# Altium project 数控936.PrjPcb
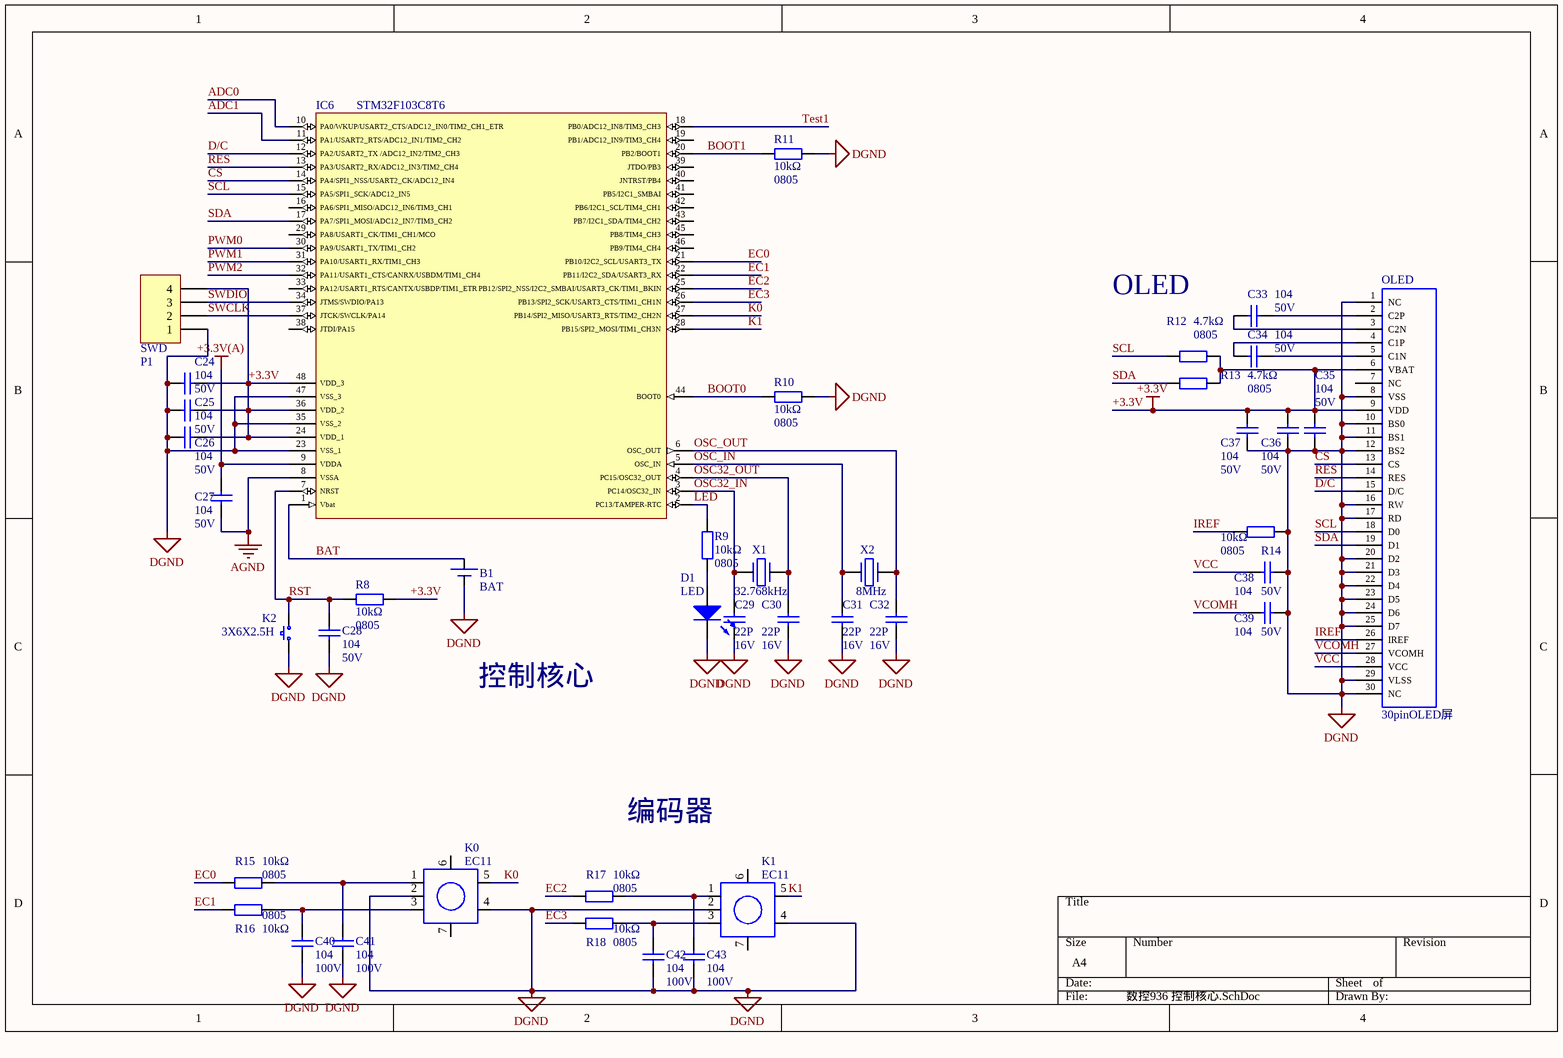
[diagram p0: 数控936 控制核心.SchDoc]
3 sheets, 106 parts. Net scope: global (net labels, ports and power ports of the same name join across sheets).
Board files: 数控936.PcbDoc, 兔子.PcbDoc, 936.PcbDoc
Sheets:
  数控936 控制核心.SchDoc
  数控936 电源部分.SchDoc
  数控936 模拟部分.SchDoc

## Sheet 数控936 控制核心.SchDoc
size A4

### Parts
B1  BAT  [CR1220]
C24  104  value 50V  [C0805]
C25  104  value 50V  [C0805]
C26  104  value 50V  [C0805]
C27  104  value 50V  [C0805]
C28  104  value 50V  [C0805]
C29  22P  value 16V  [C0805]
C30  22P  value 16V  [C0805]
C31  22P  value 16V  [C0805]
C32  22P  value 16V  [C0805]
C33  104  value 50V  [C0805]
C34  104  value 50V  [C0805]
C35  104  value 50V  [C0805]
C36  104  value 50V  [C0805]
C37  104  value 50V  [C0805]
C38  104  value 50V  [C0805]
C39  104  value 50V  [C0805]
C40  104  value 100V  [C0805]
C41  104  value 100V  [C0805]
C42  104  value 100V  [C0805]
C43  104  value 100V  [C0805]
D1  LED  [LED0805(蓝色)]
IC6  STM32F103C8T6  [LQFP-48(0.5MM) - duplicate]
K0  EC11  [EC11]
K1  EC11  [EC11]
K2  3X6X2.5H  [3X6X2.5H]
OLED  30pinOLED屏  [OLED-0.96(穿透)]
P1  SWD  [HDR2.54-LI-4P]
R8  10kΩ  value 0805  [R0805]
R9  10kΩ  value 0805  [R0805]
R10  10kΩ  value 0805  [R0805]
R11  10kΩ  value 0805  [R0805]
R12  4.7kΩ  value 0805  [R0805]
R13  4.7kΩ  value 0805  [R0805]
R14  10kΩ  value 0805  [R0805]
R15  10kΩ  value 0805  [R0805]
R16  10kΩ  value 0805  [R0805]
R17  10kΩ  value 0805  [R0805]
R18  10kΩ  value 0805  [R0805]
X1  32.768kHz  [OSC-2x6-WS]
X2  8MHz  [OSC HC-49SMD]

### Nets
+3.3V: C24.2 C25.2 C26.2 C35.2 C36.2 C37.2 IC6.24(VDD_1) IC6.36(VDD_2) IC6.48(VDD_3) OLED.6(VBAT) OLED.9(VDD) P1.4 R8.2 R12.2 R13.2
+3.3V(A): C27.2 IC6.9(VDDA)
AGND: C27.1 IC6.8(VSSA)
DGND: B1.2(-) C24.1 C25.1 C26.1 C28.1 C29.1 C30.1 C31.1 C32.1 C35.1 C36.1 C37.1 C38.2 C39.2 C40.1 C41.1 C42.1 C43.1 D1.2(K) IC6.23(VSS_1) IC6.35(VSS_2) IC6.47(VSS_3) K0.2(C) K0.4(K1) K1.2(C) K1.4(K1) K2.1 OLED.1(NC) OLED.8(VSS) OLED.10(BS0) OLED.11(BS1) OLED.12(BS2) OLED.16(RW) OLED.17(RD) OLED.20(D2) OLED.21(D3) OLED.22(D4) OLED.23(D5) OLED.24(D6) OLED.25(D7) OLED.29(VLSS) OLED.30(NC) P1.1 R10.1 R11.2 R14.2
ADC0: IC6.10(PA0/WKUP/USART2_CTS/ADC12_IN0/TIM2_CH1_ETR)
ADC1: IC6.11(PA1/USART2_RTS/ADC12_IN1/TIM2_CH2)
BAT: B1.1(+) IC6.1(Vbat)
BOOT0: IC6.44(BOOT0) R10.2
BOOT1: IC6.20(PB2/BOOT1) R11.1
CS: IC6.14(PA4/SPI1_NSS/USART2_CK/ADC12_IN4) OLED.13(CS)
D/C: IC6.12(PA2/USART2_TX_/ADC12_IN2/TIM2_CH3) OLED.15(D/C)
EC0: IC6.21(PB10/I2C2_SCL/USART3_TX) R15.1
EC1: IC6.22(PB11/I2C2_SDA/USART3_RX) R16.1
EC2: IC6.25(PB12/SPI2_NSS/I2C2_SMBAI/USART3_CK/TIM1_BKIN) R17.1
EC3: IC6.26(PB13/SPI2_SCK/USART3_CTS/TIM1_CH1N) R18.1
IREF: OLED.26(IREF) R14.1
K0: IC6.27(PB14/SPI2_MISO/USART3_RTS/TIM2_CH2N) K0.5(K2)
K1: IC6.28(PB15/SPI2_MOSI/TIM1_CH3N) K1.5(K2)
LED: IC6.2(PC13/TAMPER-RTC) R9.2
OSC32_IN: C29.2 IC6.3(PC14/OSC32_IN) X1.1
OSC32_OUT: C30.2 IC6.4(PC15/OSC32_OUT) X1.2
OSC_IN: C31.2 IC6.5(OSC_IN) X2.2
OSC_OUT: C32.2 IC6.6(OSC_OUT) X2.1
PWM0: IC6.30(PA9/USART1_TX/TIM1_CH2)
PWM1: IC6.31(PA10/USART1_RX/TIM1_CH3)
PWM2: IC6.32(PA11/USART1_CTS/CANRX/USBDM/TIM1_CH4)
RES: IC6.13(PA3/USART2_RX/ADC12_IN3/TIM2_CH4) OLED.14(RES)
RST: C28.2 IC6.7(NRST) K2.2 R8.1
SCL: IC6.15(PA5/SPI1_SCK/ADC12_IN5) OLED.18(D0) R12.1
SDA: IC6.17(PA7/SPI1_MOSI/ADC12_IN7/TIM3_CH2) OLED.19(D1) R13.1
SWCLK: IC6.37(JTCK/SWCLK/PA14) P1.2
SWDIO: IC6.34(JTMS/SWDIO/PA13) P1.3
Test1: IC6.18(PB0/ADC12_IN8/TIM3_CH3)
VCC: C38.1 OLED.28(VCC)
VCOMH: C39.1 OLED.27(VCOMH)
NetC33_1: C33.1 OLED.2(C2P)
NetC33_2: C33.2 OLED.3(C2N)
NetC34_1: C34.1 OLED.5(C1N)
NetC34_2: C34.2 OLED.4(C1P)
NetC40_2: C40.2 K0.3(B) R16.2
NetC41_2: C41.2 K0.1(A) R15.2
NetC42_2: C42.2 K1.3(B) R18.2
NetC43_2: C43.2 K1.1(A) R17.2
NetD1_1: D1.1(A) R9.1

Not connected (* = marked no-connect by the designer): IC6 16(PA6/SPI1_MISO/ADC12_IN6/TIM3_CH1) 19(PB1/ADC12_IN9/TIM3_CH4) 29(PA8/USART1_CK/TIM1_CH1/MCO) 33(PA12/USART1_RTS/CANTX/USBDP/TIM1_ETR) 38(JTDI/PA15) 39(JTDO/PB3) 40(JNTRST/PB4) 41(PB5/I2C1_SMBAI) 42(PB6/I2C1_SCL/TIM4_CH1) 43(PB7/I2C1_SDA/TIM4_CH2) 45(PB8/TIM4_CH3) 46(PB9/TIM4_CH4); K0 6 7; K1 6 7; OLED 7(NC)

### Notes on the sheet
- OLED
- 控制核心
- 编码器

### Library data of the parts
B1 = BAT: 电池
C24-C43 = 104: 无极性电容
IC6 = STM32F103C8T6: STM32单片机
K0 K1 = EC11: 旋转编码器
K2 = 3X6X2.5H: 贴片按键
OLED = 30pinOLED屏: 0.96寸
P1 = Header 4: Header, 4-Pin; LatestRevisionDate: 17-Jul-2002; LatestRevisionNote: Re-released for DXP Platform.; Publisher: Altium Limited
R8-R18 = 10kΩ: 贴片/直插电阻
X1 X2 = 8MHz: 无源晶振

## Sheet 数控936 电源部分.SchDoc
size A4
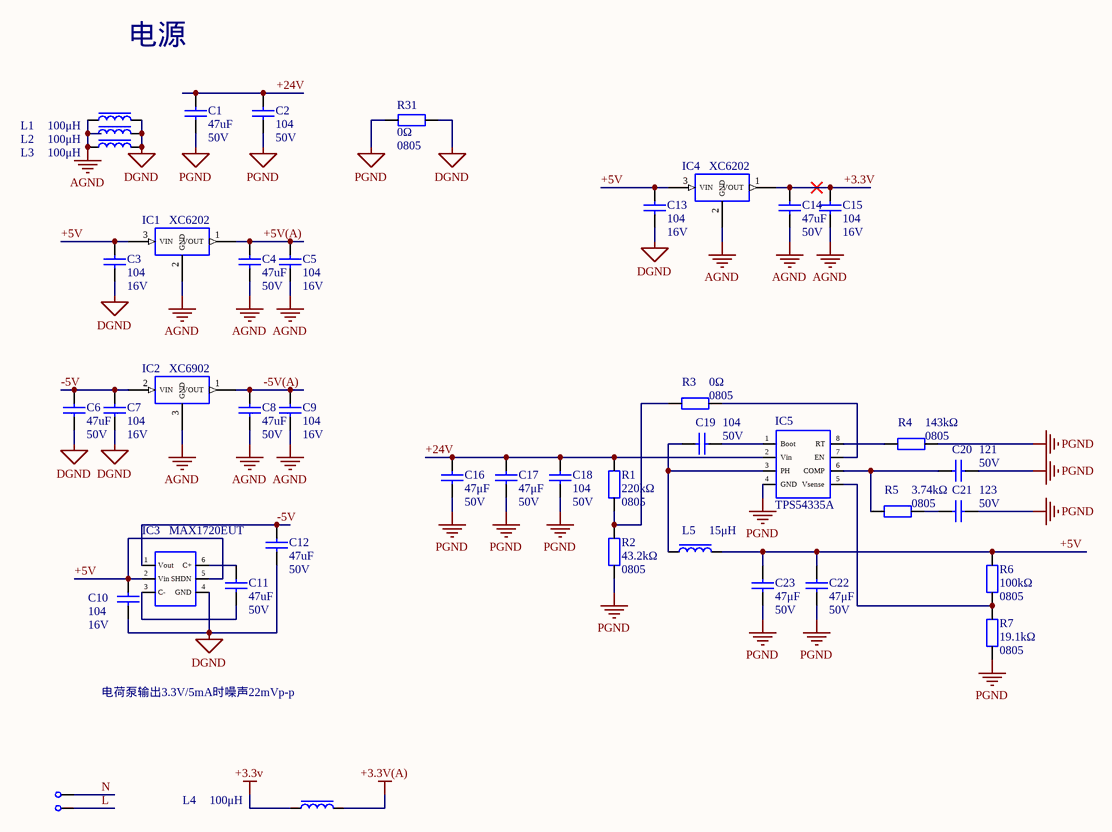
[diagram p1: 数控936 电源部分.SchDoc]

### Parts
1  point  [point]  (value not drawn)
2  point  [point]  (value not drawn)
C1  47uF  value 50V  [C1210]
C2  104  value 50V  [C0805]
C3  104  value 16V  [C0805]
C4  47uF  value 50V  [C1210]
C5  104  value 16V  [C0805]
C6  47uF  value 50V  [C1210]
C7  104  value 16V  [C0805]
C8  47uF  value 50V  [C1210]
C9  104  value 16V  [C0805]
C10  104  value 16V  [C0805]
C11  47uF  value 50V  [C1210]
C12  47uF  value 50V  [C1210]
C13  104  value 16V  [C0805]
C14  47uF  value 50V  [C1210]
C15  104  value 16V  [C0805]
C16  47μF  value 50V  [C1210]
C17  47μF  value 50V  [C1210]
C18  104  value 50V  [C0805]
C19  104  value 50V  [C0805]
C20  121  value 50V  [C0805]
C21  123  value 50V  [C0805]
C22  47μF  value 50V  [C1210]
C23  47μF  value 50V  [C1210]
IC1  XC6202  [SOT-89]
IC2  XC6902  [SOT-89]
IC3  MAX1720EUT  [TSOP-6]
IC4  XC6202  [SOT-89]
IC5  TPS54335A  [SOP-8(体宽3.8mm,底部焊盘)]
L1  100μH  [R0805]
L2  100μH  [R0805]
L3  100μH  [R0805]
L4  100μH  [R0805]
L5  15μH  [L0420]
R1  220kΩ  value 0805  [R0805]
R2  43.2kΩ  value 0805  [R0805]
R3  0Ω  value 0805  [R0805]
R4  143kΩ  value 0805  [R0805]
R5  3.74kΩ  value 0805  [R0805]
R6  100kΩ  value 0805  [R0805]
R7  19.1kΩ  value 0805  [R0805]
R31  0Ω  value 0805  [R0805]

### Nets
+3.3V: C14.2 C15.2 IC4.1(VOUT) L4.2
+3.3V(A): L4.1
+5V(A): C4.2 C5.2 IC1.1(VOUT)
-5V(A): C8.2 C9.2 IC2.1(VOUT)
AGND: C4.1 C5.1 C8.1 C9.1 C14.1 C15.1 IC1.2(GND) IC2.3(GND) IC4.2(GND) L1.2 L2.2 L3.2
DGND: C3.1 C6.1 C7.1 C10.1 C12.1 C13.1 IC3.4(GND) L1.1 L2.1 L3.1 R31.2
PGND: C1.1 C2.1 C16.1 C17.1 C18.1 C20.1 C21.1 C22.1 C23.1 IC5.4(GND) R2.1 R4.2 R7.1 R31.1
+5V: C3.2 C10.2 C13.2 C22.2 C23.2 IC1.3(VIN) IC3.2(Vin) IC3.5(SHDN) IC4.3(VIN) L5.1 R6.2
+24V: C1.2 C2.2 C16.2 C17.2 C18.2 IC5.2(Vin) R1.2
-5V: C6.2 C7.2 C12.2 IC2.2(VIN) IC3.1(Vout)
L: 2.1
N: 1.1
NetC11_1: C11.1 IC3.3(C-)
NetC11_2: C11.2 IC3.6(C+)
NetC19_1: C19.1 IC5.3(PH) L5.2
NetC19_2: C19.2 IC5.1(Boot)
NetC20_2: C20.2 IC5.6(COMP) R5.2
NetC21_2: C21.2 R5.1
NetIC5_5: IC5.5(Vsense) R6.1 R7.2
NetIC5_7: IC5.7(EN) R3.2
NetIC5_8: IC5.8(RT) R4.1
NetR1_1: R1.1 R2.2 R3.1

### Notes on the sheet
- 电源
- 电荷泵输出3.3V/5mA时噪声22mVp-p

### Library data of the parts
1 2 = point: 焊盘
C1-C23 = 104: 无极性电容
IC1 IC2 IC4 = AMS1117-3.3: LDO
IC3 = MAX1720EUT: 负压电荷泵
IC5 = TPS54335A: buck型电源管理
L1-L5 = 470mH: 电感
R1-R7 R31 = 10kΩ: 贴片/直插电阻

## Sheet 数控936 模拟部分.SchDoc
size A4
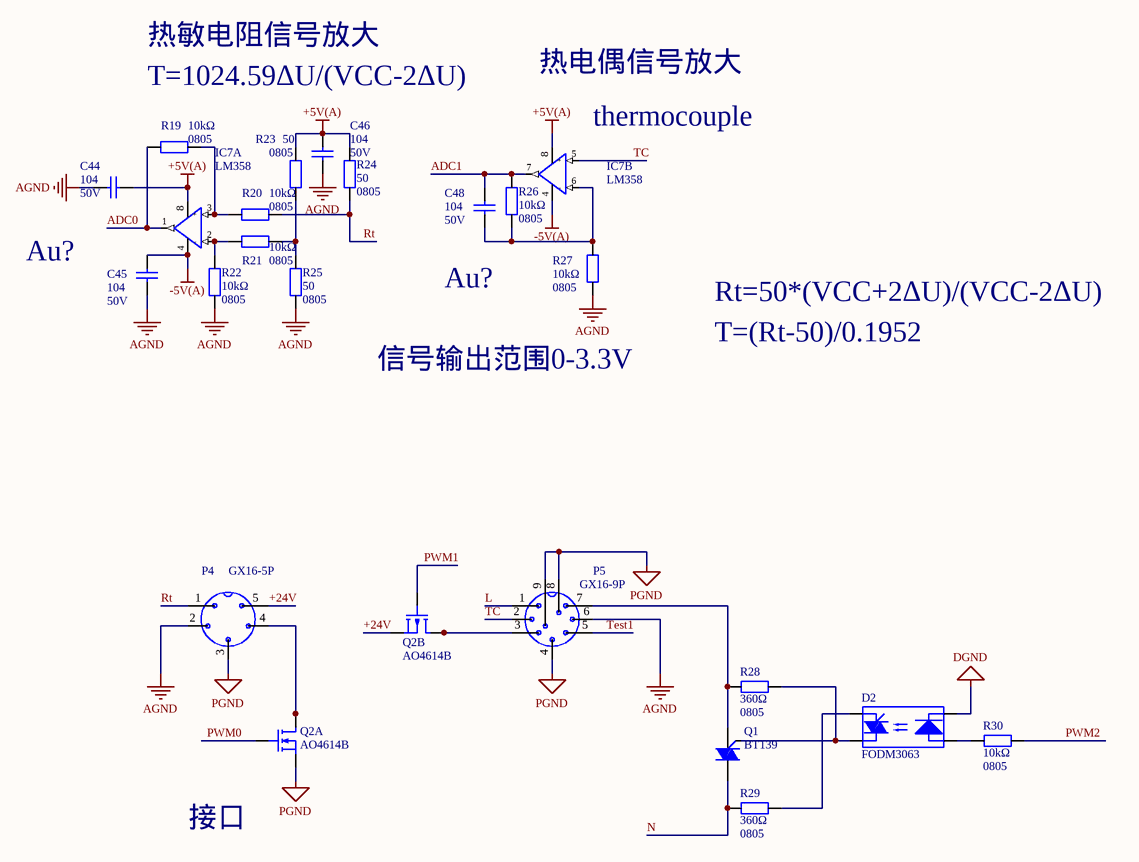
[diagram p2: 数控936 模拟部分.SchDoc]

### Parts
C44  104  value 50V  [C0805]
C45  104  value 50V  [C0805]
C46  104  value 50V  [C0805]
C48  104  value 50V  [C0805]
D2  FODM3063  [SOP4-2.54]
IC7  LM358  [SOP-8(体宽3.8mm)]  (parts A,B of 2)
P4  GX16-5P  [GX16-5P]
P5  GX16-9P  [GX16-9P]
Q1  BT139  [TO-252]
Q2  AO4614B  [SOP-8(体宽3.8mm)]  (parts A,B of 2)
R19  10kΩ  value 0805  [R0805]
R20  10kΩ  value 0805  [R0805]
R21  10kΩ  value 0805  [R0805]
R22  10kΩ  value 0805  [R0805]
R23  50  value 0805  [R0805]
R24  50  value 0805  [R0805]
R25  50  value 0805  [R0805]
R26  10kΩ  value 0805  [R0805]
R27  10kΩ  value 0805  [R0805]
R28  360Ω  value 0805  [R0805]
R29  360Ω  value 0805  [R0805]
R30  10kΩ  value 0805  [R0805]

### Nets
+5V(A): C44.2 C46.2 IC7.8(vcc) R23.2 R24.2
-5V(A): C45.2 IC7.4(vee)
AGND: C44.1 C45.1 C46.1 P4.2(传感器-) P5.6 R22.1 R25.1 R27.1
DGND: D2.2(cathode)
PGND: P4.3(地) P5.4 P5.8 P5.9 Q2.1(S)
+24V: P4.5(加热) Q2.3(S)
ADC0: IC7.1(out) R19.1
ADC1: C48.2 IC7.7(out) R26.1
L: P5.1
N: Q1.2(A2) R29.1
PWM0: Q2.2(G)
PWM1: Q2.4(G)
PWM2: R30.1
Rt: P4.1(传感器+) R20.2 R24.1
TC: IC7.5(+) P5.2
Test1: P5.5
NetC48_1: C48.1 IC7.6(-) R26.2 R27.2
NetD2_1: D2.1(anode) R30.2
NetD2_3: D2.3(main_term) R29.2
NetD2_4: D2.4(main_term) Q1.3(G) R28.1
NetIC7_2: IC7.2(-) R21.1 R22.2
NetIC7_3: IC7.3(+) R19.2 R20.1
NetP4_4: P4.4(加热) Q2.7(D) Q2.8(D)
NetP5_3: P5.3 Q2.5(D) Q2.6(D)
NetP5_7: P5.7 Q1.1(A1) R28.2
NetR21_2: R21.2 R23.1 R25.2

### Notes on the sheet
- 热敏电阻信号放大
- T=1024.59ΔU/(VCC-2ΔU)
- 热电偶信号放大
- (near IC7) thermocouple
- Au?
- Rt=50*(VCC+2ΔU)/(VCC-2ΔU)
- 信号输出范围0-3.3V
- T=(Rt-50)/0.1952
- 接口

### Library data of the parts
C44-C46 C48 = 104: 无极性电容
D2 = FODM3063: 过零光耦
IC7 = LM358: 运放
P4 = GX16-5P: 航空插座
P5 = GX16-9P: 航空插座
Q1 = BTA16: 双向可控硅
Q2 = AO4614B: N-P复合MOSFET
R19-R30 = 10kΩ: 贴片/直插电阻

## Nets that join several sheets
+3.3V: 数控936 控制核心 (15 pins), 数控936 电源部分 (C14.2 C15.2 IC4.1 L4.2)
+3.3V(A): 数控936 控制核心 (C27.2 IC6.9), 数控936 电源部分 (L4.1)
+5V(A): 数控936 电源部分 (C4.2 C5.2 IC1.1), 数控936 模拟部分 (5 pins)
-5V(A): 数控936 电源部分 (C8.2 C9.2 IC2.1), 数控936 模拟部分 (C45.2 IC7.4)
AGND: 数控936 控制核心 (C27.1 IC6.8), 数控936 电源部分 (12 pins), 数控936 模拟部分 (8 pins)
DGND: 数控936 控制核心 (46 pins), 数控936 电源部分 (11 pins), 数控936 模拟部分 (D2.2)
PGND: 数控936 电源部分 (14 pins), 数控936 模拟部分 (5 pins)
+24V: 数控936 电源部分 (7 pins), 数控936 模拟部分 (P4.5 Q2.3)
ADC0: 数控936 控制核心 (IC6.10), 数控936 模拟部分 (IC7.1 R19.1)
ADC1: 数控936 控制核心 (IC6.11), 数控936 模拟部分 (C48.2 IC7.7 R26.1)
L: 数控936 电源部分 (2.1), 数控936 模拟部分 (P5.1)
N: 数控936 电源部分 (1.1), 数控936 模拟部分 (Q1.2 R29.1)
PWM0: 数控936 控制核心 (IC6.30), 数控936 模拟部分 (Q2.2)
PWM1: 数控936 控制核心 (IC6.31), 数控936 模拟部分 (Q2.4)
PWM2: 数控936 控制核心 (IC6.32), 数控936 模拟部分 (R30.1)
Test1: 数控936 控制核心 (IC6.18), 数控936 模拟部分 (P5.5)